# EAGLE design LFO_V01 (EAGLE 9.0.1)
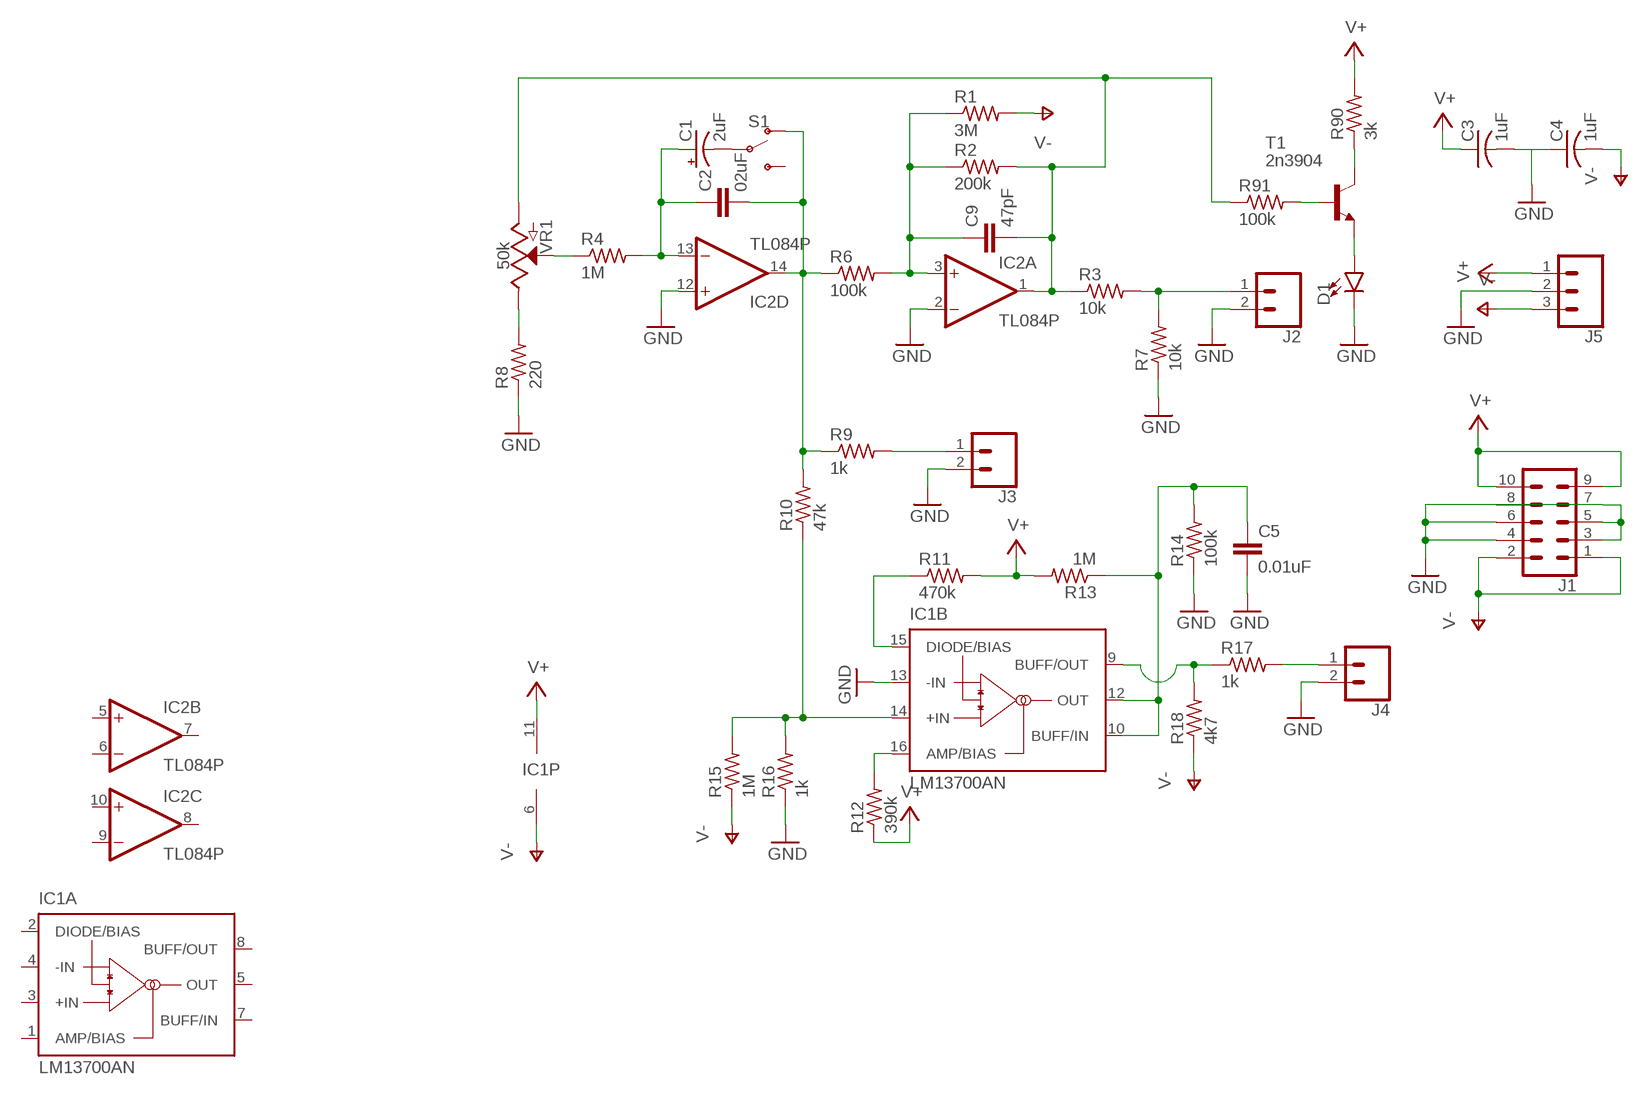
[diagram p0: schematic, sheet 1]

## Parts
C1  2uF  CPOL-USE3.5-8  [E3,5-8]
C2  02uF  C-EU050-025X075  [C050-025X075]
C3  1uF  C-US102-043X133  [C102-043X133]
C4  1uF  C-US102-043X133  [C102-043X133]
C5  0.01uF  C-EU050-024X044  [C050-024X044]
C9  47pF  C-EU050-025X075  [C050-025X075]
D1  LED5MM-KIT  [LED_5MM-KIT]
IC1  LM13700AN  LM13600AN  [DIL16]
IC2  TL084P  [DIL14]
J1  CONN_05X2SHD  [2X5-SHROUDED]
J2  CONN_023.5MM-NO_SILK  [SCREWTERMINAL-3.5MM-2-NS]
J3  CONN_023.5MM-NO_SILK  [SCREWTERMINAL-3.5MM-2-NS]
J4  CONN_023.5MM-NO_SILK  [SCREWTERMINAL-3.5MM-2-NS]
J5  CONN_03-SCREW-5MM  [SCREWTERMINAL-5MM-3]
R1  3M  R-US_0204/7  [0204/7]
R2  200k  R-US_0204/7  [0204/7]
R3  10k  R-US_0204/7  [0204/7]
R4  1M  R-US_0204/7  [0204/7]
R6  100k  R-US_0204/7  [0204/7]
R7  10k  R-US_0204/7  [0204/7]
R8  220  R-US_0204/7  [0204/7]
R9  1k  R-US_0204/7  [0204/7]
R10  47k  R-US_0204/7  [0204/7]
R11  470k  R-US_0204/7  [0204/7]
R12  390k  R-US_0204/7  [0204/7]
R13  1M  R-US_0204/7  [0204/7]
R14  100k  R-US_0204/7  [0204/7]
R15  1M  R-US_0204/7  [0204/7]
R16  1k  R-US_0204/7  [0204/7]
R17  1k  R-US_0204/7  [0204/7]
R18  4k7  R-US_0204/7  [0204/7]
R90  3k  R-US_0204/7  [0204/7]
R91  100k  R-US_0204/7  [0204/7]
S1  SWITCH-SPDT-PTH-11.6X4.0MM  [SWITCH_SPDT_PTH_11.6X4.0MM]
T1  2n3904  -NPN-TO92-EBC  [TO92-EBC]
VR1  50k  POTENTIOMETER-PTH-9MM-1/20W-20%-KIT  [POT-PTH-ALPS-KIT]

## Nets
GND: C3.2 C4.1 C5.2 D1.K(C) IC1.13(B:-IN) IC2.2(A:-IN) IC2.12(D:+IN) J1.3 J1.4 J1.5 J1.6 J1.7 J1.8 J2.2 J3.2 J4.2 J5.2 R7.1 R8.1 R14.1 R16.1
N$1: C2.2 IC2.14(D:OUT) R6.1 R9.1 R10.2 S1.1(O)
N$2: C9.1 IC2.3(A:+IN) R1.1 R2.1 R6.2
N$3: C1.+ C2.1 IC2.13(D:-IN) R4.2
N$4: C9.2 IC2.1(A:OUT) R2.2 R3.1 R91.1 VR1.P$3(A)
N$5: C1.- S1.2(P)
N$6: R91.2 T1.B
N$7: R90.1 T1.C
N$8: J2.1 R3.2 R7.2
N$9: R4.1 VR1.P$2(S)
N$10: R8.2 VR1.P$1(E)
N$11: IC1.14(B:+IN) R10.1 R15.2 R16.2
N$12: D1.A T1.E
N$13: IC1.15(B:DIODE/BIAS) R11.1
N$14: J3.1 R9.2
N$15: C5.1 IC1.10(B:BUFF/IN) IC1.12(B:OUT) R13.1 R14.2
N$16: IC1.16(B:AMP/BIAS) R12.2
N$18: IC1.9(B:BUFF/OUT) R17.1 R18.2
N$19: J4.1 R17.2
V+: C3.1 IC1.11(P:V+) J1.9 J1.10 J5.1 R11.2 R12.1 R13.2 R90.2
V-: C4.2 IC1.6(P:V-) J1.1 J1.2 J5.3 R1.2 R15.1 R18.1
Unconnected: IC1.1(A:AMP/BIAS) IC1.2(A:DIODE/BIAS) IC1.3(A:+IN) IC1.4(A:-IN) IC1.5(A:OUT) IC1.7(A:BUFF/IN) IC1.8(A:BUFF/OUT) IC2.5(B:+IN) IC2.6(B:-IN) IC2.7(B:OUT) IC2.8(C:OUT) IC2.9(C:-IN) IC2.10(C:+IN) S1.3(S)

## Power pins joined to a net without a drawn wire
V+: IC2.4(P:V+)
V-: IC2.11(P:V-)

## Library data of the parts
C1 = resistor:CPOL-US: POLARIZED CAPACITOR, American symbol
C2 C9 = resistor:C-EU: CAPACITOR, European symbol
C3 C4 = rcl:C-US: CAPACITOR, American symbol; SPICEPREFIX: C
C5 = rcl:C-EU: CAPACITOR, European symbol; SPICEPREFIX: C
D1 = SparkFun-LED:LED: LED (Generic) Standard schematic elements and footprints for 5mm, 3mm, 1206, and 0603 sized LEDs. Generic LEDs with no color specified.
IC1 = national-semiconductor:LM13600: Dual Operational Transconductance Amplifiers with Linearizing Diodes and Buffers Source: lm13600.PDF
IC2 = linear:TL084: OP AMP
J1 = SparkFun-Connectors:CONN_05X2: Multi connection point. Often used as Generic Header-pin footprint for 0.1 inch spaced/style header connections For AVR SPI programming port, see special device with nice symbol: "AVR_SPI_PROG_5x2.dev" You can populate with any combo of single row headers, but if you'd like an exact match, check these: 2x5 AVR ICSP Male Header <https://www.sparkfun.com/products/778> (PRT-00778) 2x5 Pin Shrouded Header <https://www.sparkfun.com/products/8506> (PRT-08506) On any of the 0.1 inch spaced packages, you can populate with these: Break Away Headers - Straight <https://www.sparkfun.com/products/116> (PRT-00116) Break Away Male Headers - Right Angle <https://www.sparkfun.com/products/553> (PRT-00553) Female Headers <https://www.sparkfun.com/products/115> (PRT-00115) Break Away Headers - Machine Pin <https://www.sparkfun.com/products/117> (PRT-00117) Break Away Female Headers - Swiss Machine Pin <https://www.sparkfun.com/products/743> (PRT-00743) Special note: the shrouded connector mates well with our 5x2 ribbon cables: 2x5 Pin IDC Ribbon Cable <https://www.sparkfun.com/products/8535> (PRT-08535); PROD_ID: CONN-08671; SF_ID: PRT-08506
J2-J4 = SparkFun-Connectors:CONN_02: Multi connection point. Often used as Generic Header-pin footprint for 0.1 inch spaced/style header connections On any of the 0.1 inch spaced packages, you can populate with these: Break Away Headers - Straight <https://www.sparkfun.com/products/116> (PRT-00116) Break Away Male Headers - Right Angle <https://www.sparkfun.com/products/553> (PRT-00553) Female Headers <https://www.sparkfun.com/products/115> (PRT-00115) Break Away Headers - Machine Pin <https://www.sparkfun.com/products/117> (PRT-00117) Break Away Female Headers - Swiss Machine Pin <https://www.sparkfun.com/products/743> (PRT-00743) For SCREWTERMINALS and SPRING TERMINALS visit here: Screw Terimnals on SparkFun.com <https://www.sparkfun.com/search/results?term=Screw+Terminals> (5mm/3.5mm/2.54mm spacing) This device is also useful as a general connection point to wire up your design to another part of your project. Our various solder wires solder well into these plated through hole pads. Hook-Up Wire - Assortment (Stranded, 22 AWG) <https://www.sparkfun.com/products/11375> (PRT-11375) Hook-Up Wire - Assortment (Solid Core, 22 AWG) <https://www.sparkfun.com/products/11367> (PRT-11367) View the entire wire category on our website here <https://www.sparkfun.com/categories/141> Special notes: Molex polarized connector foot print use with: PRT-08233 with associated crimp pins and housings. 2.54_SCREWTERM for use with PRT-10571. 3.5mm Screw Terminal footprints for PRT-08084 5mm Screw Terminal footprints for use with PRT-08432; PROD_ID: CONN-08399
J5 = SparkFun-Connectors:CONN_03: Multi connection point. Often used as Generic Header-pin footprint for 0.1 inch spaced/style header connections On any of the 0.1 inch spaced packages, you can populate with these: Break Away Headers - Straight <https://www.sparkfun.com/products/116> (PRT-00116) Break Away Male Headers - Right Angle <https://www.sparkfun.com/products/553> (PRT-00553) Female Headers <https://www.sparkfun.com/products/115> (PRT-00115) Break Away Headers - Machine Pin <https://www.sparkfun.com/products/117> (PRT-00117) Break Away Female Headers - Swiss Machine Pin <https://www.sparkfun.com/products/743> (PRT-00743) Stackable Header - 3 Pin (Female, 0.1") <https://www.sparkfun.com/products/13875> (PRT-13875) For SCREWTERMINALS and SPRING TERMINALS visit here: Screw Terimnals on SparkFun.com <https://www.sparkfun.com/search/results?term=Screw+Terminals> (5mm/3.5mm/2.54mm spacing) This device is also useful as a general connection point to wire up your design to another part of your project. Our various solder wires solder well into these plated through hole pads. Hook-Up Wire - Assortment (Stranded, 22 AWG) <https://www.sparkfun.com/products/11375> (PRT-11375) Hook-Up Wire - Assortment (Solid Core, 22 AWG) <https://www.sparkfun.com/products/11367> (PRT-11367) View the entire wire category on our website here <https://www.sparkfun.com/categories/141> Special notes: Molex polarized connector foot print use with SKU : PRT-08232 with associated crimp pins and housings.; PROD_ID: CONN-10134; SF_SKU: PRT-08433
R1-R4 R6-R18 R90 R91 = resistor:R-US_: RESISTOR, American symbol
S1 = SparkFun-Switches:SWITCH-SPDT: Single Pole, Double Throw (SPDT) Switch Single-pole, double-throw (SPDT) switch. Variant Overview SMD-AYZ0202 Surface Mount DPDT Switch <https://www.sparkfun.com/products/597> (COM-00597) Used on e.g. LilyPad Arduino USB - ATmega32U4 Board <https://www.sparkfun.com/products/12049> PTH-11.6X4.0MM SPDT Mini Power Switch <https://www.sparkfun.com/products/102> (COM-00102) Used on e.g. SparkFun Simon Says - Through-Hole Soldering Kit <https://www.sparkfun.com/products/10547> (KIT-10547) PTH-11.6X4.0MM-KIT KIT version of SPDT Mini Power Switch - Simplifies soldering by removing tStop of switch pins - only one side can be soldered. PTH-11.6X4.0MM-LOCK LOCK version of SPDT Mini Power Switch - Offset pins hold switch in place for easier soldering. SMD-RIGHT-ANGLE Surface Mount Right Angle Switch <https://www.sparkfun.com/products/10860> (COM-10860) Used on e.g. SparkFun ESP8266 Thing <https://www.sparkfun.com/products/13231>; PROD_ID: SWCH-08261; SF_SKU: COM-00102
T1 = transistor:*-NPN-: NPN Transistror BF959 corrected 2008.03.06
VR1 = SparkFun-Resistors:POTENTIOMETER: Potentiometer (Pot) Three-terminal potentiometers, with an adjustable wiper and two adjustable resistors. A pot can be used to create a configurable voltage divider, or as a variable resistor. Variants ALPS_POT and ALPS_POT_KIT - PTH, breadboard compatible, 9mm square pots Rotary Potentiometer - Linear (10k ohm) <https://www.sparkfun.com/products/9288> (COM-09288) The KIT variant exposes copper on only one side of the PTH pad, so the part can only be assembled on one side of the PCB. Useful for beginner soldering kits.; PROD_ID: RES-09177; SF_SKU: COM-09288; VALUE: 10k

## Board
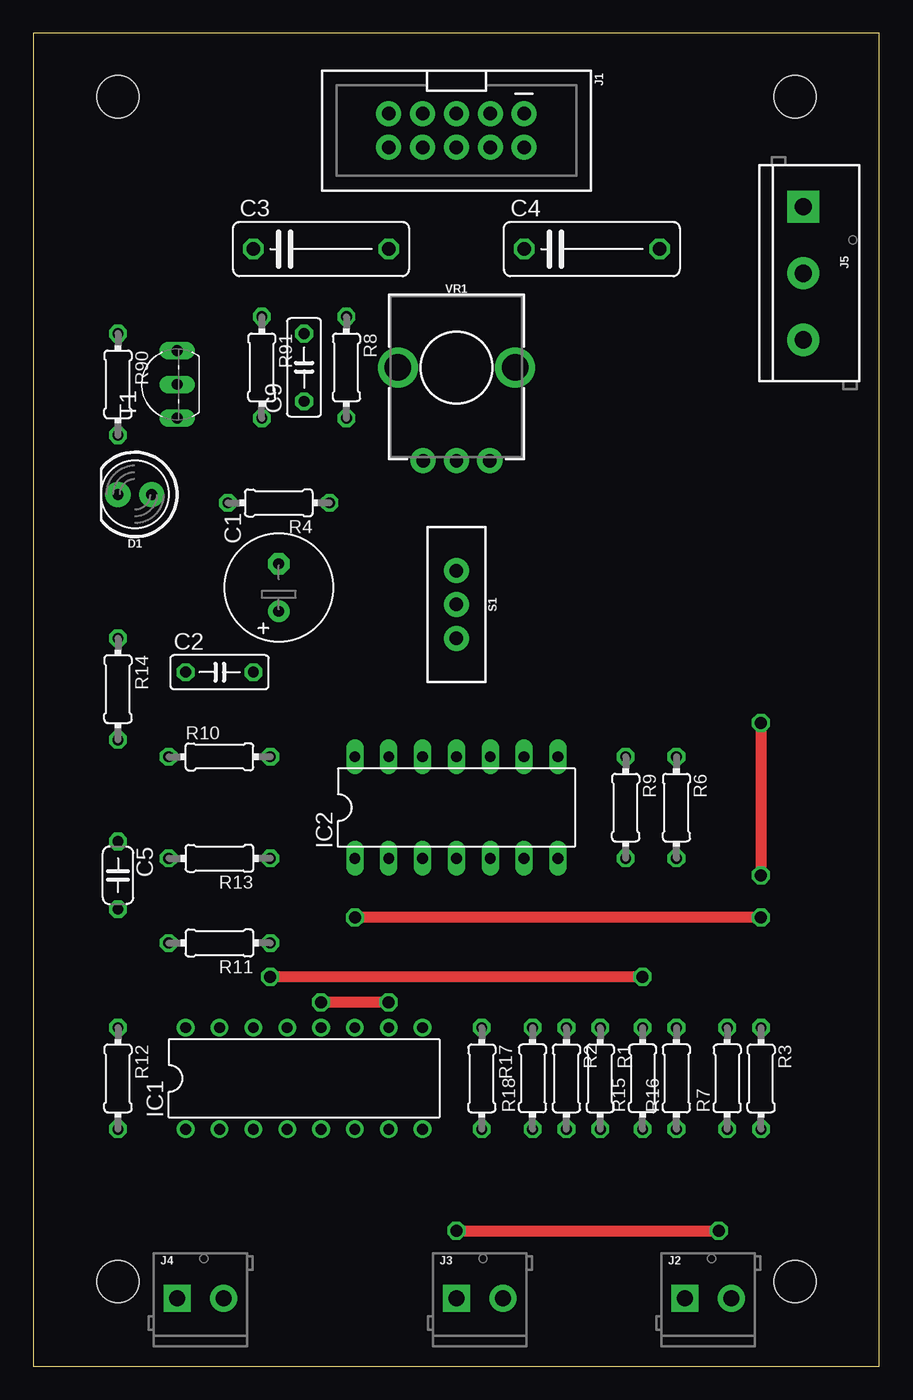
[diagram p1: board, top side]
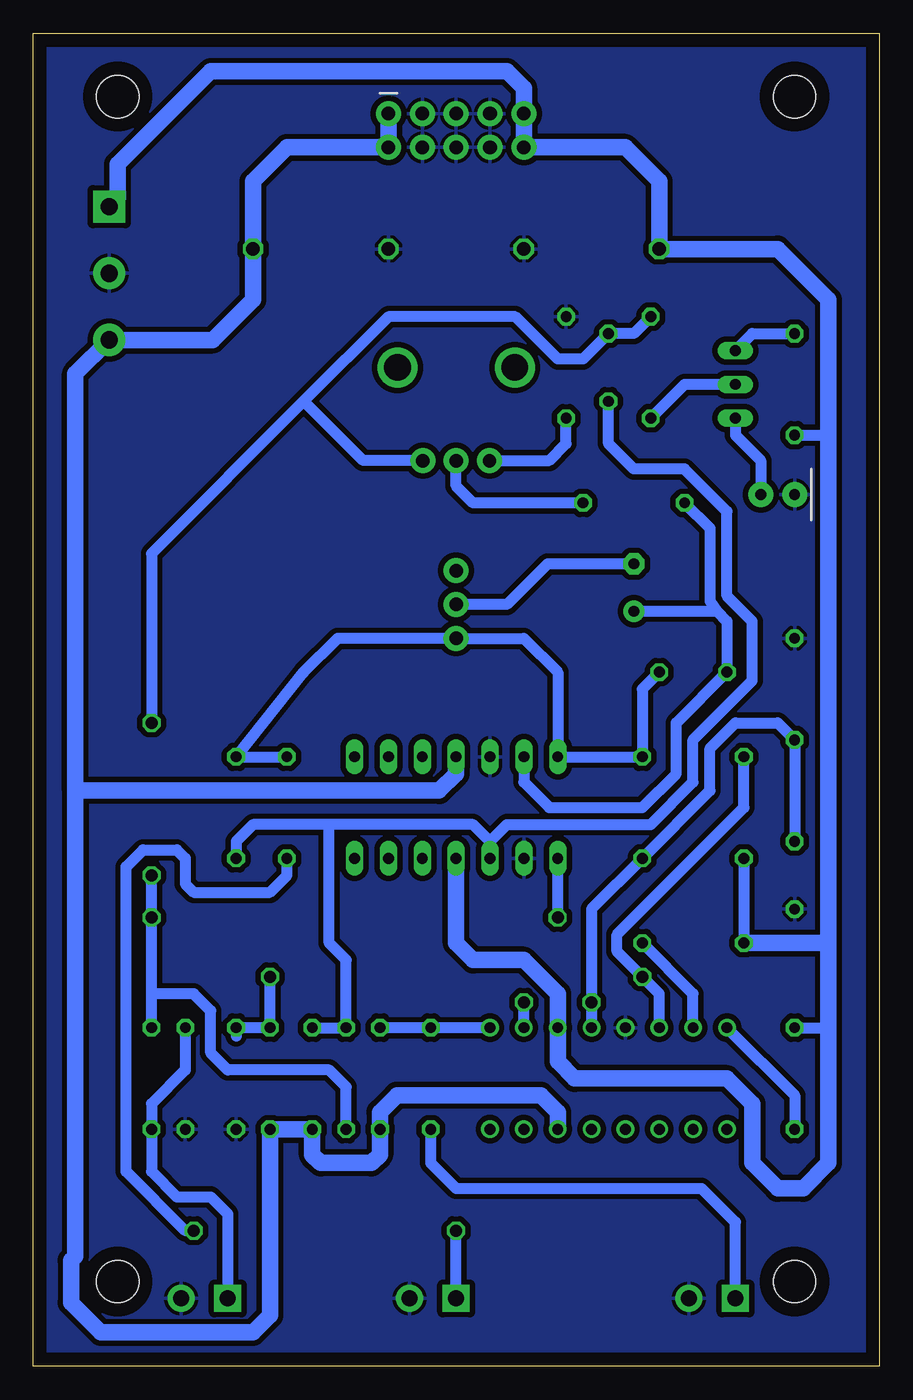
[diagram p2: board, bottom side, seen from below]

Size 63.48 x 100 mm. Coordinates in mm from the lower left corner, seen from the top.
Outline: 0,0 63.48,0 63.48,100 0,100 0,0
Copper layers (1*16): Top 0.035mm / dielectric 1.5mm / Bottom 0.035mm
Design rules "default": minimum track width 6mil, minimum drill 0.35mm, track to track 6mil, track to pad 6mil, pad to pad 6mil, via to via 6mil, smd to smd 6mil, copper to edge 40mil, drill to drill 6mil, minimum pad ring 10mil, minimum via ring 8mil, stop-mask expansion 4mil, vias tented up to drill 0mil, thermal gap 10mil
Holes 3.17 mm at 6.35,95.25 57.15,95.25 6.35,6.35 57.15,6.35

### Footprints (pad centres in the part's own frame; a part is rotated, then mirrored left to right if it is on the bottom)
E3,5-8 = drill 0.813 pad 1.6: + -1.778,0 | drill 0.813 pad 1.6 octagon: - 1.778,0
C050-025X075 = drill 0.813 octagon: 1 -2.54,0; 2 2.54,0
C102-043X133 = drill 1.016 octagon: 1 -5.08,0; 2 5.08,0
C050-024X044 = drill 0.813 octagon: 1 -2.54,0; 2 2.54,0
LED_5MM-KIT = drill 0.813 pad 1.88: A -1.27,0; K 1.27,0
DIL16 = drill 0.813 pad 1.27: 1 -8.89,-3.81; 2 -6.35,-3.81; 3 -3.81,-3.81; 4 -1.27,-3.81; 5 1.27,-3.81; 6 3.81,-3.81; 7 6.35,-3.81; 8 8.89,-3.81; 9 8.89,3.81; 10 6.35,3.81; 11 3.81,3.81; 12 1.27,3.81; 13 -1.27,3.81; 14 -3.81,3.81; 15 -6.35,3.81; 16 -8.89,3.81
DIL14 = drill 0.813 long: 1 -7.62,-3.81; 2 -5.08,-3.81; 3 -2.54,-3.81; 4 0,-3.81; 5 2.54,-3.81; 6 5.08,-3.81; 7 7.62,-3.81; 8 7.62,3.81; 9 5.08,3.81; 10 2.54,3.81; 11 0,3.81; 12 -2.54,3.81; 13 -5.08,3.81; 14 -7.62,3.81
2X5-SHROUDED = drill 1.016 pad 1.88: 1 -1.27,5.08; 2 1.27,5.08; 3 -1.27,2.54; 4 1.27,2.54; 5 -1.27,0; 6 1.27,0; 7 -1.27,-2.54; 8 1.27,-2.54; 9 -1.27,-5.08; 10 1.27,-5.08
SCREWTERMINAL-3.5MM-2-NS = drill 1.2 pad 2.032 square: 1 0,0 | drill 1.2 pad 2.032: 2 3.5,0
SCREWTERMINAL-5MM-3 = drill 1.3 pad 2.413 square: 1 0,0 | drill 1.3 pad 2.413: 2 5,0; 3 10,0
0204/7 = drill 0.813 octagon: 1 -3.81,0; 2 3.81,0
SWITCH_SPDT_PTH_11.6X4.0MM = drill 1.016 pad 1.88: 1 0,2.54; 2 0,0; 3 0,-2.54
TO92-EBC = drill 0.813 long: B 0,-1.27; C 2.54,-1.27; E -2.54,-1.27
POT-PTH-ALPS-KIT = drill 1 pad 1.88: P$1 7,-2.5; P$2 7,0; P$3 7,2.5 | drill 2: P$4 0,-4.4; P$5 0,4.4

### Placement (x,y rotation side)
C1  18.41,58.42 90 top
C2  13.97,52.07 0 top
C3  21.59,83.82 0 top
C4  41.91,83.82 0 top
C5  6.35,36.83 270 top
C9  20.32,74.93 90 top
D1  7.62,65.41 180 top
IC1  20.32,21.59 0 top
IC2  31.75,41.91 0 top
J1  31.75,92.71 270 top
J2  48.9,5.08 0 top
J3  31.75,5.08 0 top
J4  10.79,5.08 0 top
J5  57.78,87 270 top
R1  42.55,21.59 270 top
R2  40.01,21.59 270 top
R3  54.61,21.59 270 top
R4  18.41,64.77 180 top
R6  48.26,41.91 270 top
R7  52.07,21.59 90 top
R8  23.5,74.93 270 top
R9  44.45,41.91 270 top
R10  13.97,45.72 0 top
R11  13.97,31.75 180 top
R12  6.35,21.59 270 top
R13  13.97,38.1 180 top
R14  6.35,50.8 270 top
R15  45.72,21.59 90 top
R16  48.26,21.59 90 top
R17  33.66,21.59 270 top
R18  37.47,21.59 90 top
R90  6.35,73.66 270 top
R91  17.14,74.93 270 top
S1  31.75,57.15 180 top
T1  9.53,73.66 90 top
VR1  31.75,74.93 270 top

### Tracks (layer width: path | path; a pad name or v marks a point on that pad's centre or on a via)
GND
  pour Bottom (isolate 0.406): 0,100.33 63.5,100.33 63.5,0 0,0
N$1
  Bottom 0.813: R9.1 R6.1 43.18,52.07 40.64,54.61 S1.1 26.67,54.61 24.13,52.07 IC2.14 R10.2 17.78,50.8 C2.2
N$2
  Bottom 0.813: 29.21,39.37 30.48,40.64 41.27,40.64 | R6.2 48.26,39.37 46.99,40.64 41.27,40.64 | R1.1 R2.1 40.01,30.48 41.27,31.75 41.27,40.64 | IC2.3 29.21,39.37 | 29.21,39.37 27.94,40.64 17.14,40.64 13.97,43.81 13.97,46.99 9.53,51.44 9.53,55.88 11.43,57.78 11.43,64.14 14.61,67.31 18.41,67.31 20.32,69.22 C9.1
N$3
  Bottom 0.813: C1.+ 12.19,56.64 | 12.19,56.64 11.43,55.88 C2.1 15.24,48.26 15.24,44.45 17.78,41.91 24.77,41.91 26.67,43.81 IC2.13 | 12.19,56.64 12.7,57.4 12.7,62.87 R4.2
N$4  (via drill 0.9)
  Top 0.813: v54.61,33.66 v24.13,33.66 | v54.61,48.26 v54.61,36.83
  Bottom 0.813: R2.2 40.01,20.95 41.27,22.23 48.9,22.23 50.16,23.5 50.16,26.67 51.44,27.94 54.61,27.94 | R3.1 54.61,27.94 | R91.1 18.41,77.47 C9.2 22.23,75.56 24.13,75.56 27.3,78.74 36.83,78.74 43.18,72.39 | v24.13,33.66 IC2.1 | 54.61,27.94 v54.61,33.66 v54.61,36.83 | 43.18,72.39 54.61,60.96 v54.61,48.26 | VR1.P$3 34.27,67.94 38.73,67.94 43.18,72.39
N$5
  Bottom 0.813: C1.- 24.89,60.2 27.94,57.15 S1.2
N$6
  Bottom 0.813: T1.B 14.61,73.66 R91.2
N$7
  Bottom 0.813: T1.C 9.53,77.47 R90.1
N$8
  Bottom 0.813: R7.2 52.07,22.23 54.61,19.68 R3.2 54.61,14.61 52.7,12.7 50.16,12.7 48.9,11.43 J2.1
N$9
  Bottom 0.813: VR1.P$2 31.75,66.04 30.48,64.77 R4.1
N$10
  Bottom 0.813: VR1.P$1 29.23,67.94 24.77,67.94 23.5,69.22 R8.2
N$11  (via drill 0.9)
  Top 0.813: v45.72,29.21 v17.78,29.21
  Bottom 0.813: 48.26,24.77 R16.2 R15.2 v45.72,29.21 | IC1.14 16.51,27.94 v17.78,29.21 19.68,31.11 19.68,32.38 10.16,41.91 R10.1
N$12
  Bottom 0.813: T1.E 10.79,69.85 8.89,67.94 D1.A
N$13
  Bottom 0.813: IC1.15 13.97,27.94 R11.1
N$14  (via drill 0.9)
  Top 0.813: v31.75,10.16 v51.44,10.16
  Bottom 0.813: J3.1 v31.75,10.16 | v51.44,10.16 52.07,10.16 56.52,14.61 56.52,37.47 55.24,38.73 52.7,38.73 52.07,38.1 52.07,36.2 51.44,35.56 45.72,35.56 44.45,36.83 R9.2
N$15  (via drill 0.9)
  Top 0.813: v26.67,27.3 v21.59,27.3
  Bottom 0.813: IC1.12 v21.59,27.3 21.59,34.29 R13.1 12.7,43.18 12.7,46.35 10.79,48.26 7.62,48.26 R14.2 C5.1 | IC1.10 v26.67,27.3
N$16
  Bottom 0.813: IC1.16 6.35,20.32 R12.2
N$18
  Bottom 0.813: R18.2 R17.1 IC1.9
N$19
  Bottom 0.813: J4.1 10.79,10.79 13.34,13.34 31.75,13.34 33.66,15.24 R17.2
V+
  Bottom 0.813: R90.2 3.81,69.85 | R13.2 R11.2 | R12.1 3.81,25.4
  Bottom 1.219: 3.81,31.75 3.81,69.85 3.81,80.01 7.62,83.82 C3.1 16.51,88.9 19.05,91.44 J1.10 J1.9 26.67,95.89 27.94,97.16 50.16,97.16 57.15,90.17 57.15,87.63 J5.1 | 3.81,31.75 3.81,25.4 3.81,15.24 5.71,13.34 7.62,13.34 9.53,15.24 9.53,19.68 11.43,21.59 22.86,21.59 24.13,22.86 IC1.11 24.13,27.94 26.67,30.48 30.48,30.48 31.75,31.75 IC2.4 | R11.2 3.81,31.75
V-
  Bottom 1.219: J1.1 J1.2 44.45,91.44 46.99,88.9 C4.2 46.99,80.01 50.01,77 J5.3 60.33,74.45 60.33,43.18 | 60.33,43.18 60.33,8.26 60.64,7.94 60.64,4.76 58.42,2.54 46.99,2.54 45.72,3.81 R15.1 R1.2 42.55,15.88 41.91,15.24 38.1,15.24 37.47,15.88 R18.1 37.47,19.05 36.2,20.32 25.4,20.32 24.13,19.05 IC1.6 | IC2.11 31.75,44.45 33.02,43.18 60.33,43.18